# EAGLE schematic LAUNCHXL2_570LC43_RM57L (EAGLE 7.3.0), part 2 of 2
## Sheet 14 of 17
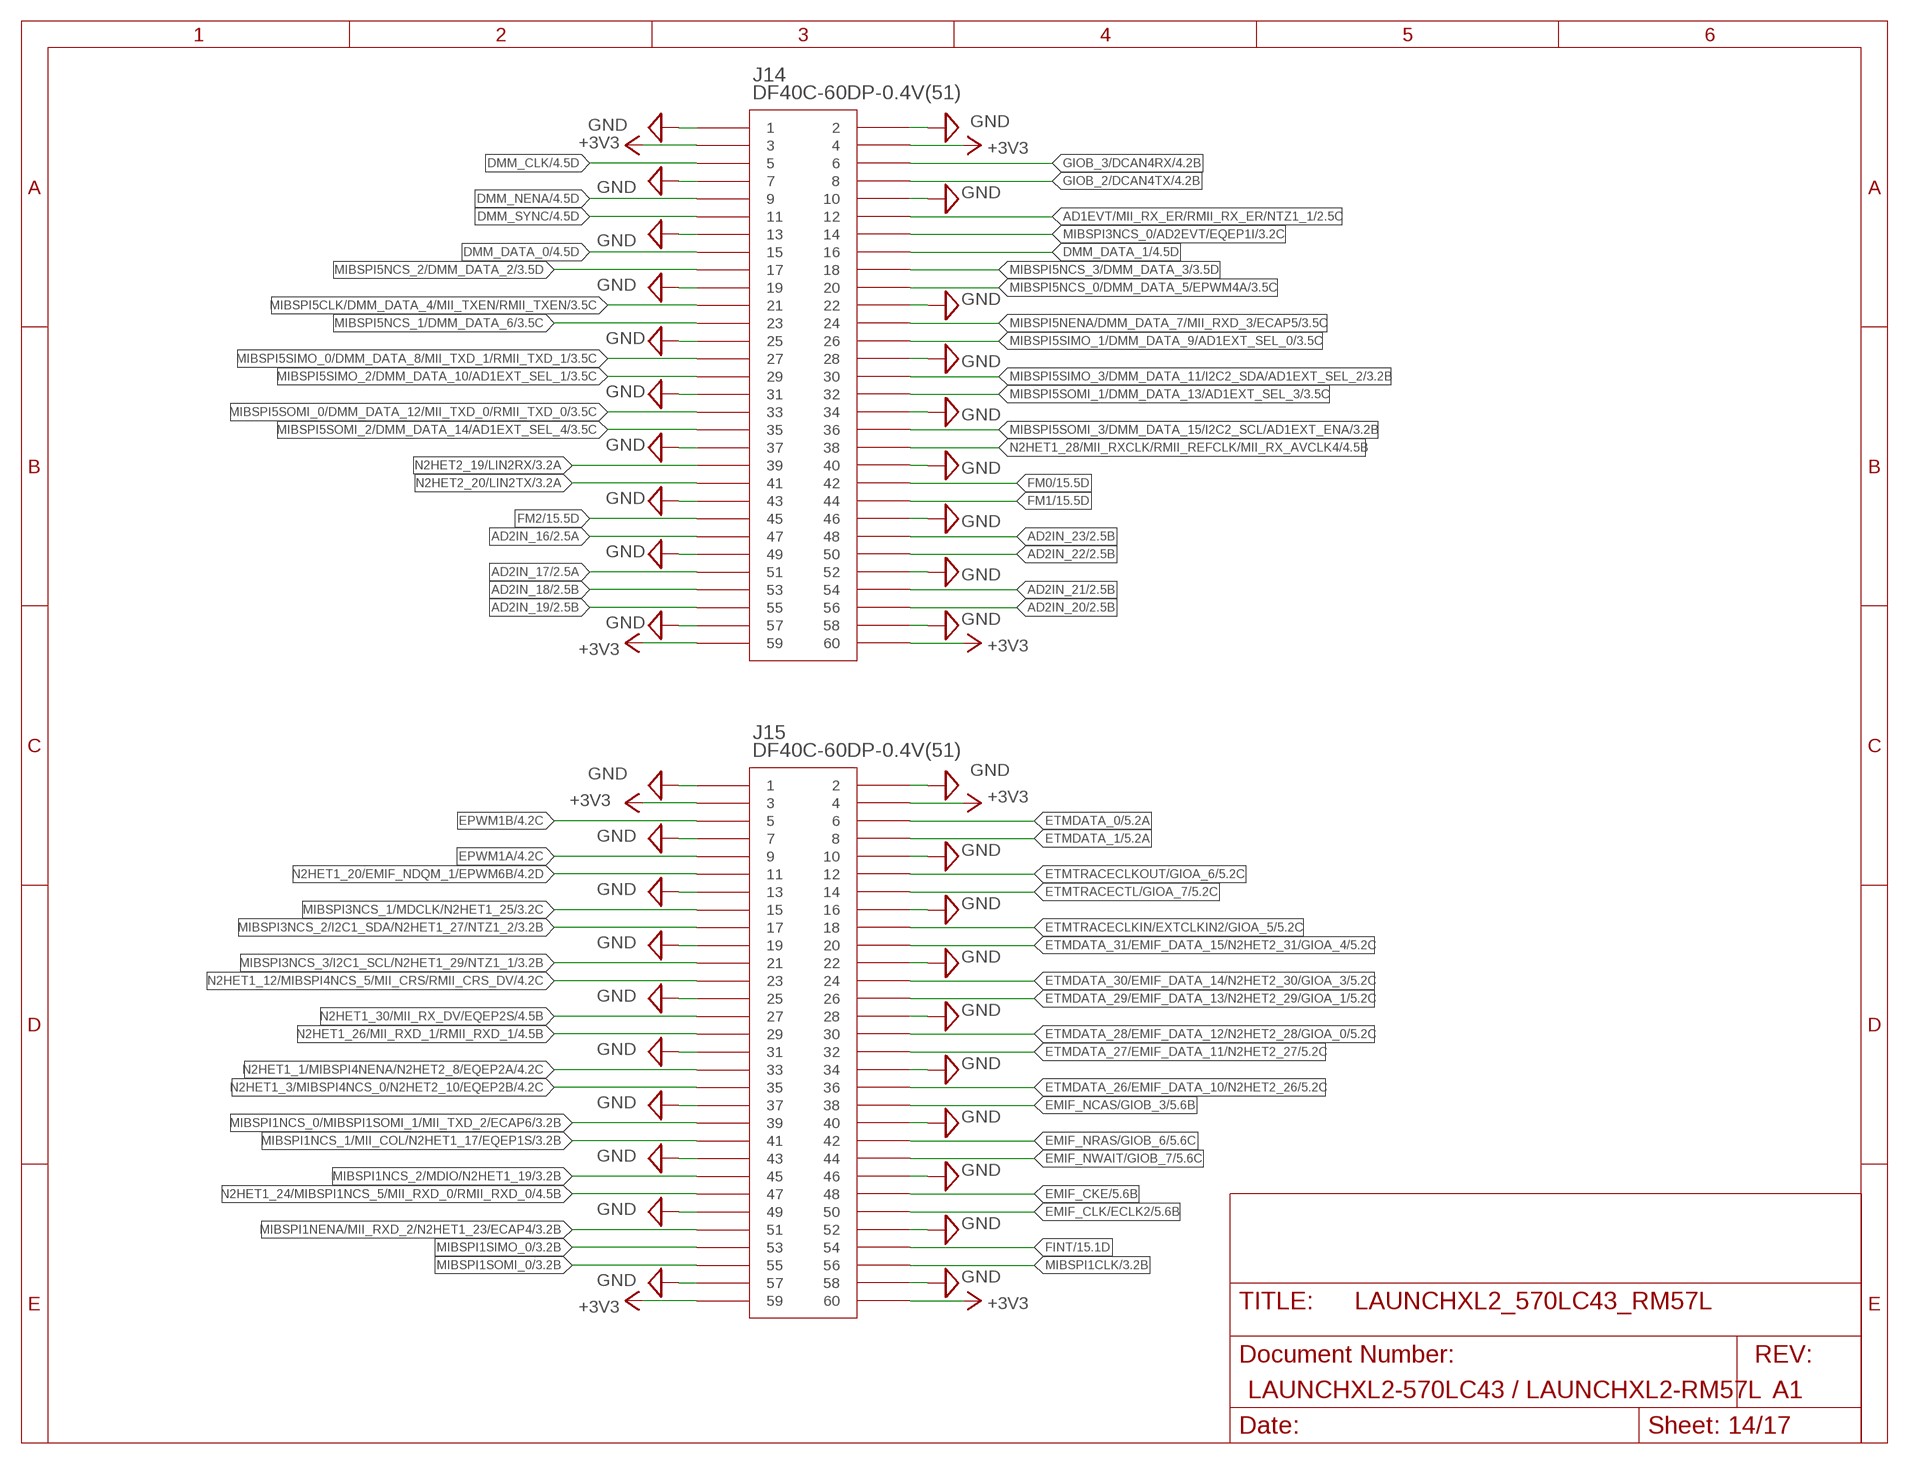
[diagram p13: schematic, sheet 14]

### Parts
J14  DF40C-60DP-0.4V(51)  [DF40C-60DP-0.4V(51)]
J15  DF40C-60DP-0.4V(51)  [DF40C-60DP-0.4V(51)]

### Nets
+3V3 [pwr]: J14.3 J14.4 J14.59 J14.60 J15.3 J15.4 J15.59 J15.60 ; also sheet 2,3,5,6,7,8,9,10,11,12,13,15,16
AD1EVT/MII_RX_ER/RMII_RX_ER/NTZ1_1: J14.12 ; also sheet 2,8
AD2IN_16: J14.47 ; also sheet 2
AD2IN_17: J14.51 ; also sheet 2
AD2IN_18: J14.53 ; also sheet 2
AD2IN_19: J14.55 ; also sheet 2
AD2IN_20: J14.56 ; also sheet 2
AD2IN_21: J14.54 ; also sheet 2
AD2IN_22: J14.50 ; also sheet 2
AD2IN_23: J14.48 ; also sheet 2,9
DMM_CLK: J14.5 ; also sheet 4
DMM_DATA_0: J14.15 ; also sheet 4
DMM_DATA_1: J14.16 ; also sheet 4
DMM_NENA: J14.9 ; also sheet 4
DMM_SYNC: J14.11 ; also sheet 4
EMIF_CKE [EMIF]: J15.48 ; also sheet 5
EMIF_CLK/ECLK2 [EMIF]: J15.50 ; also sheet 5
EMIF_NCAS/GIOB_3 [EMIF]: J15.38 ; also sheet 5
EMIF_NRAS/GIOB_6 [EMIF]: J15.42 ; also sheet 5
EMIF_NWAIT/GIOB_7 [EMIF]: J15.44 ; also sheet 5
EPWM1A: J15.9 ; also sheet 4,9
EPWM1B: J15.5 ; also sheet 4,9
ETMDATA_0: J15.6 ; also sheet 5
ETMDATA_1: J15.8 ; also sheet 5
ETMDATA_26/EMIF_DATA_10/N2HET2_26: J15.36 ; also sheet 5
ETMDATA_27/EMIF_DATA_11/N2HET2_27: J15.32 ; also sheet 5
ETMDATA_28/EMIF_DATA_12/N2HET2_28/GIOA_0: J15.30 ; also sheet 5
ETMDATA_29/EMIF_DATA_13/N2HET2_29/GIOA_1: J15.26 ; also sheet 5
ETMDATA_30/EMIF_DATA_14/N2HET2_30/GIOA_3: J15.24 ; also sheet 5
ETMDATA_31/EMIF_DATA_15/N2HET2_31/GIOA_4: J15.20 ; also sheet 5
ETMTRACECLKIN/EXTCLKIN2/GIOA_5: J15.18 ; also sheet 5
ETMTRACECLKOUT/GIOA_6: J15.12 ; also sheet 5
ETMTRACECTL/GIOA_7: J15.14 ; also sheet 5
FINT: J15.54 ; also sheet 15
FM0: J14.42 ; also sheet 15
FM1: J14.44 ; also sheet 15
FM2: J14.45 ; also sheet 15
GIOB_2/DCAN4TX: J14.8 ; also sheet 4,7,9
GIOB_3/DCAN4RX: J14.6 ; also sheet 4,7,9
GND [pwr]: J14.1 J14.2 J14.7 J14.10 J14.13 J14.19 J14.22 J14.25 J14.28 J14.31 J14.34 J14.37 J14.40 J14.43 J14.46 J14.49 J14.52 J14.57 J14.58 J15.1 J15.2 J15.7 J15.10 J15.13 J15.16 J15.19 J15.22 J15.25 J15.28 J15.31 J15.34 J15.37 J15.40 J15.43 J15.46 J15.49 J15.52 J15.57 J15.58 ; also sheet 2,3,5,6,7,8,9,10,11,12,13,15,16,17
MIBSPI1CLK: J15.56 ; also sheet 3,8,13
MIBSPI1NCS_0/MIBSPI1SOMI_1/MII_TXD_2/ECAP6: J15.39 ; also sheet 3,8
MIBSPI1NCS_1/MII_COL/N2HET1_17/EQEP1S: J15.41 ; also sheet 3,8
MIBSPI1NCS_2/MDIO/N2HET1_19: J15.45 ; also sheet 3,8
MIBSPI1NENA/MII_RXD_2/N2HET1_23/ECAP4: J15.51 ; also sheet 3,8
MIBSPI1SIMO_0: J15.53 ; also sheet 3,8
MIBSPI1SOMI_0: J15.55 ; also sheet 3,8
MIBSPI3NCS_0/AD2EVT/EQEP1I: J14.14 ; also sheet 3,8
MIBSPI3NCS_1/MDCLK/N2HET1_25: J15.15 ; also sheet 3,7
MIBSPI3NCS_2/I2C1_SDA/N2HET1_27/NTZ1_2: J15.17 ; also sheet 3,7
MIBSPI3NCS_3/I2C1_SCL/N2HET1_29/NTZ1_1: J15.21 ; also sheet 3,7
MIBSPI5CLK/DMM_DATA_4/MII_TXEN/RMII_TXEN: J14.21 ; also sheet 3,8
MIBSPI5NCS_0/DMM_DATA_5/EPWM4A: J14.20 ; also sheet 3,9
MIBSPI5NCS_1/DMM_DATA_6: J14.23 ; also sheet 3
MIBSPI5NCS_2/DMM_DATA_2: J14.17 ; also sheet 3
MIBSPI5NCS_3/DMM_DATA_3: J14.18 ; also sheet 3
MIBSPI5NENA/DMM_DATA_7/MII_RXD_3/ECAP5: J14.24 ; also sheet 3,8
MIBSPI5SIMO_0/DMM_DATA_8/MII_TXD_1/RMII_TXD_1: J14.27 ; also sheet 3,8
MIBSPI5SIMO_1/DMM_DATA_9/AD1EXT_SEL_0: J14.26 ; also sheet 3
MIBSPI5SIMO_2/DMM_DATA_10/AD1EXT_SEL_1: J14.29 ; also sheet 3
MIBSPI5SIMO_3/DMM_DATA_11/I2C2_SDA/AD1EXT_SEL_2: J14.30 ; also sheet 3,9
MIBSPI5SOMI_0/DMM_DATA_12/MII_TXD_0/RMII_TXD_0: J14.33 ; also sheet 3,8
MIBSPI5SOMI_1/DMM_DATA_13/AD1EXT_SEL_3: J14.32 ; also sheet 3
MIBSPI5SOMI_2/DMM_DATA_14/AD1EXT_SEL_4: J14.35 ; also sheet 3
MIBSPI5SOMI_3/DMM_DATA_15/I2C2_SCL/AD1EXT_ENA: J14.36 ; also sheet 3,9
N2HET1_1/MIBSPI4NENA/N2HET2_8/EQEP2A: J15.33 ; also sheet 4,8,9
N2HET1_3/MIBSPI4NCS_0/N2HET2_10/EQEP2B: J15.35 ; also sheet 4,9
N2HET1_12/MIBSPI4NCS_5/MII_CRS/RMII_CRS_DV: J15.23 ; also sheet 4,7
N2HET1_20/EMIF_NDQM_1/EPWM6B: J15.11 ; also sheet 4
N2HET1_24/MIBSPI1NCS_5/MII_RXD_0/RMII_RXD_0: J15.47 ; also sheet 4,8
N2HET1_26/MII_RXD_1/RMII_RXD_1: J15.29 ; also sheet 4,8
N2HET1_28/MII_RXCLK/RMII_REFCLK/MII_RX_AVCLK4: J14.38 ; also sheet 4,8
N2HET1_30/MII_RX_DV/EQEP2S: J15.27 ; also sheet 4,7
N2HET2_19/LIN2RX: J14.39 ; also sheet 3,9
N2HET2_20/LIN2TX: J14.41 ; also sheet 3,9

## Sheet 15 of 17
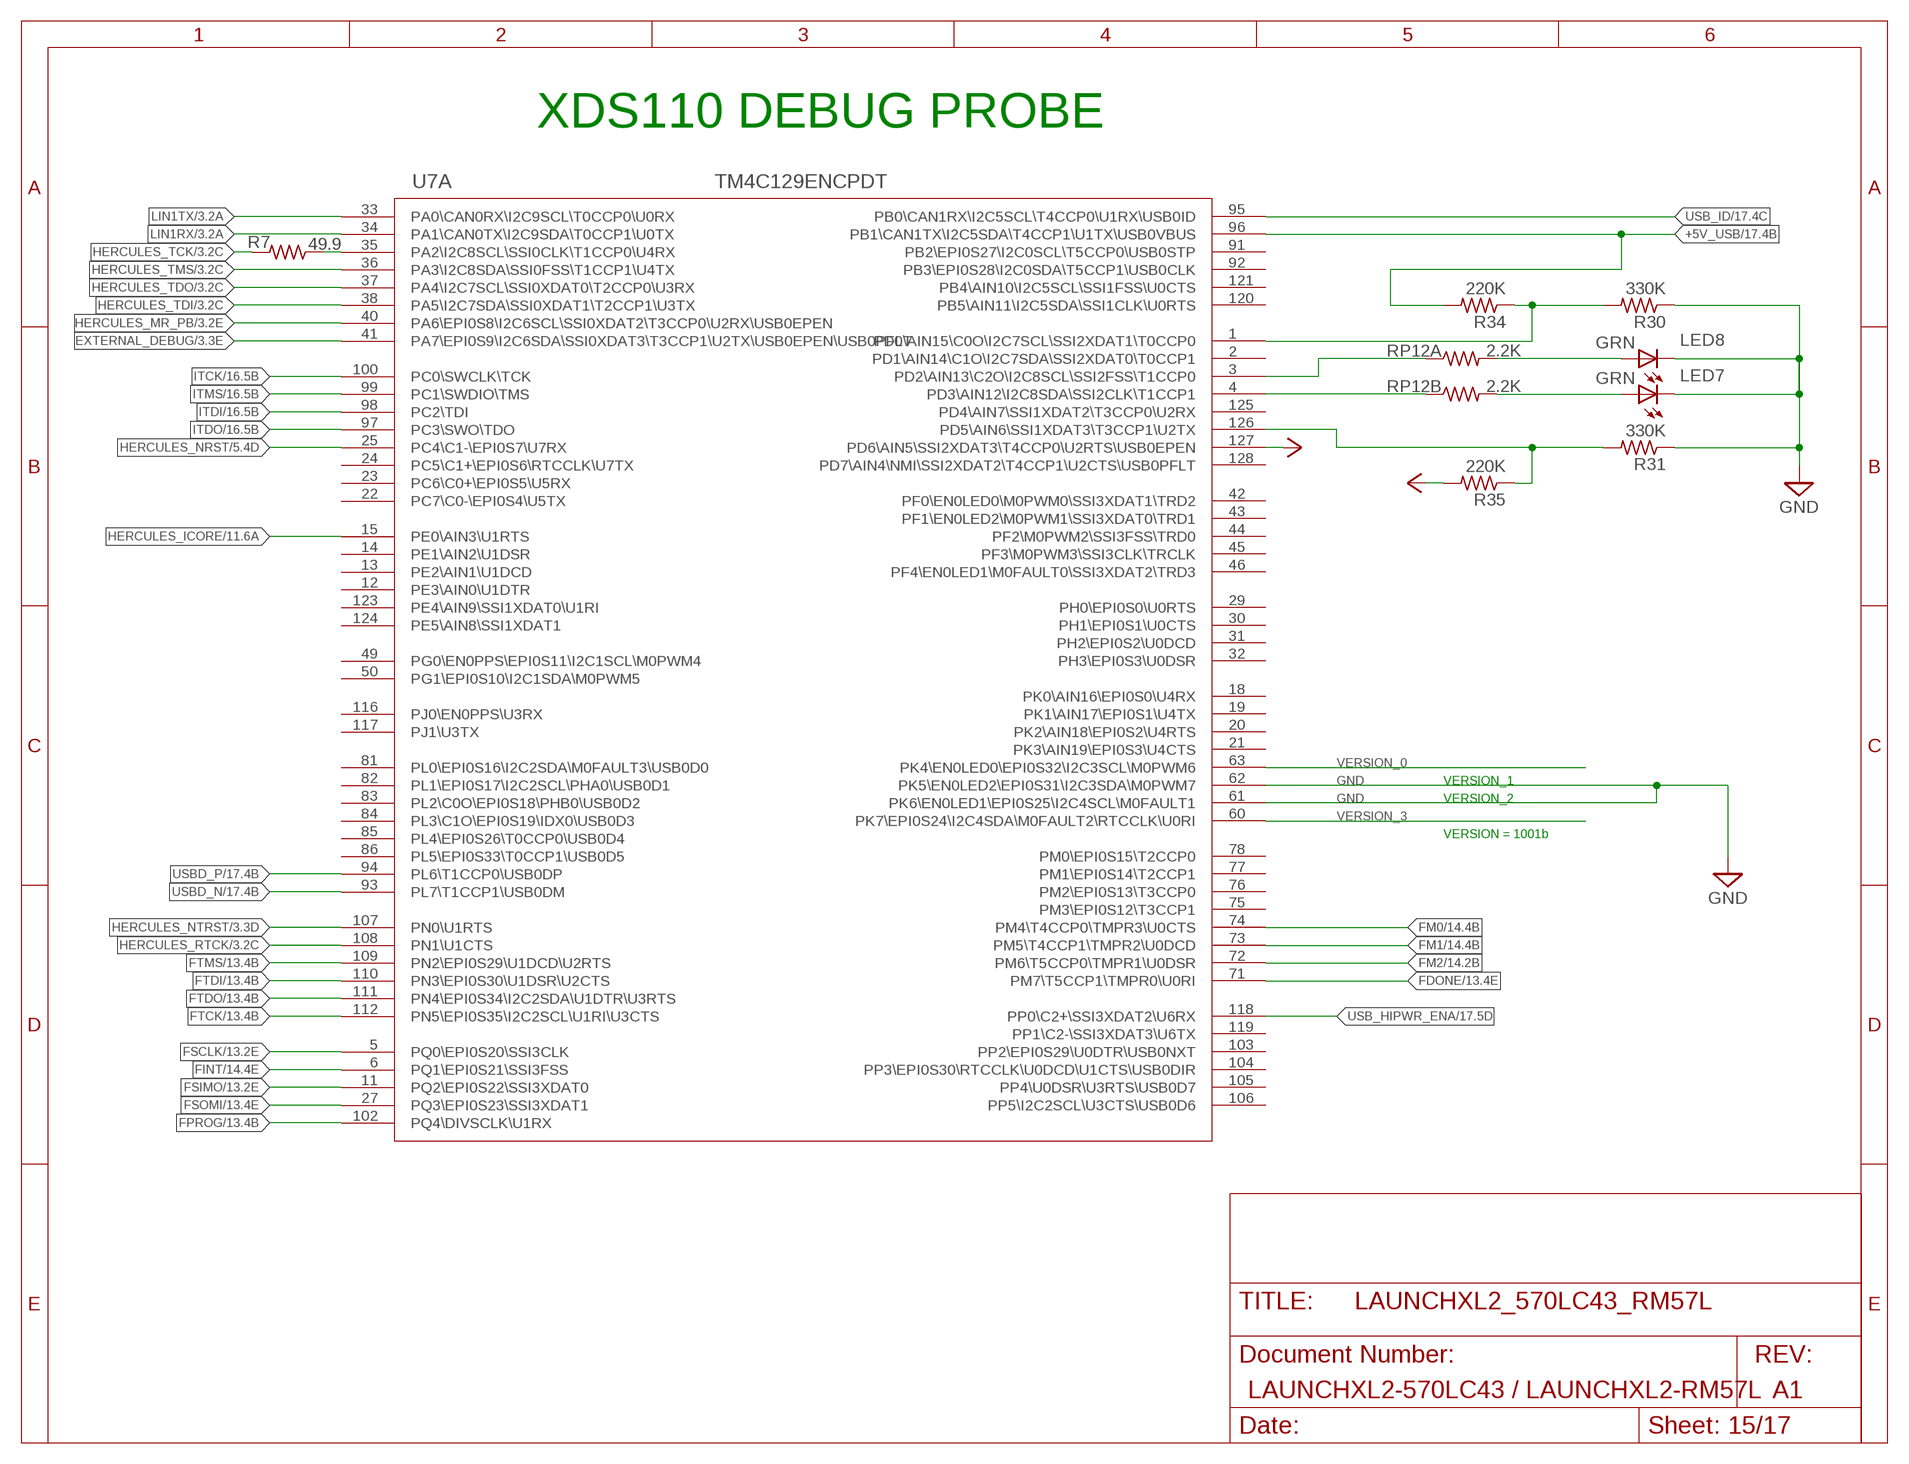
[diagram p14: schematic, sheet 15]

### Parts
LED7  GRN  LEDCHIPLED_0603  [CHIPLED_0603]
LED8  GRN  LEDCHIPLED_0603  [CHIPLED_0603]
R7  49.9  R-US_R0201  [R0201]
R30  330K  R-US_R0201  [R0201]
R31  330K  R-US_R0201  [R0201]
R34  220K  R-US_R0201  [R0201]
R35  220K  R-US_R0201  [R0201]
RP12  2.2K  R-ARRAY-8_  [RP8_1506_1606]
U7  TM4C129ENCPDT  [PDT128]

### Nets
+1V2 [pwr]: U7.127(A:PD6\AIN5\SSI2XDAT3\T4CCP0\U2RTS\USB0EPEN) ; also sheet 5,6,11
+3V3 [pwr]: R35.2 ; also sheet 2,3,5,6,7,8,9,10,11,12,13,14,16
+5V_USB: R34.2 U7.96(A:PB1\CAN1TX\I2C5SDA\T4CCP1\U1TX\USB0VBUS) ; also sheet 17
EXTERNAL_DEBUG: U7.41(A:PA7\EPI0S9\I2C6SDA\SSI0XDAT3\T3CCP1\U2TX\USB0EPEN\USB0PFLT) ; also sheet 3,13
FDONE: U7.71(A:PM7\T5CCP1\TMPR0\U0RI) ; also sheet 13
FINT: U7.6(A:PQ1\EPI0S21\SSI3FSS) ; also sheet 14
FM0: U7.74(A:PM4\T4CCP0\TMPR3\U0CTS) ; also sheet 14
FM1: U7.73(A:PM5\T4CCP1\TMPR2\U0DCD) ; also sheet 14
FM2: U7.72(A:PM6\T5CCP0\TMPR1\U0DSR) ; also sheet 14
FPROG: U7.102(A:PQ4\DIVSCLK\U1RX) ; also sheet 13
FSCLK: U7.5(A:PQ0\EPI0S20\SSI3CLK) ; also sheet 13
FSIMO: U7.11(A:PQ2\EPI0S22\SSI3XDAT0) ; also sheet 13
FSOMI: U7.27(A:PQ3\EPI0S23\SSI3XDAT1) ; also sheet 13
FTCK: U7.112(A:PN5\EPI0S35\I2C2SCL\U1RI\U3CTS) ; also sheet 13
FTDI: U7.110(A:PN3\EPI0S30\U1DSR\U2CTS) ; also sheet 13
FTDO: U7.111(A:PN4\EPI0S34\I2C2SDA\U1DTR\U3RTS) ; also sheet 13
FTMS: U7.109(A:PN2\EPI0S29\U1DCD\U2RTS) ; also sheet 13
GND [pwr]: LED7.C LED8.C R30.1 R31.1 U7.61(A:PK6\EN0LED1\EPI0S25\I2C4SCL\M0FAULT1) U7.62(A:PK5\EN0LED2\EPI0S31\I2C3SDA\M0PWM7) ; also sheet 2,3,5,6,7,8,9,10,11,12,13,14,16,17
HERCULES_ICORE: U7.15(A:PE0\AIN3\U1RTS) ; also sheet 11
HERCULES_MR_PB: U7.40(A:PA6\EPI0S8\I2C6SCL\SSI0XDAT2\T3CCP0\U2RX\USB0EPEN) ; also sheet 3,5,13
HERCULES_NRST: U7.25(A:PC4\C1-\EPI0S7\U7RX) ; also sheet 5,7,8,9,13
HERCULES_NTRST: U7.107(A:PN0\U1RTS) ; also sheet 3,13
HERCULES_RTCK [ETM]: U7.108(A:PN1\U1CTS) ; also sheet 3,13
HERCULES_TCK [ETM]: R7.2 ; also sheet 3,13
HERCULES_TDI: U7.38(A:PA5\I2C7SDA\SSI0XDAT1\T2CCP1\U3TX) ; also sheet 3,13
HERCULES_TDO: U7.37(A:PA4\I2C7SCL\SSI0XDAT0\T2CCP0\U3RX) ; also sheet 3,13
HERCULES_TMS: U7.36(A:PA3\I2C8SDA\SSI0FSS\T1CCP1\U4TX) ; also sheet 3,13
ITCK: U7.100(A:PC0\SWCLK\TCK) ; also sheet 16
ITDI: U7.98(A:PC2\TDI) ; also sheet 16
ITDO: U7.97(A:PC3\SWO\TDO) ; also sheet 16
ITMS: U7.99(A:PC1\SWDIO\TMS) ; also sheet 16
LIN1RX: U7.34(A:PA1\CAN0TX\I2C9SDA\T0CCP1\U0TX) ; also sheet 3,8
LIN1TX: U7.33(A:PA0\CAN0RX\I2C9SCL\T0CCP0\U0RX) ; also sheet 3,8
N$1: RP12.3 U7.4(A:PD3\AIN12\I2C8SDA\SSI2CLK\T1CCP1)
N$2: LED7.A RP12.4
N$6: RP12.1 U7.3(A:PD2\AIN13\C2O\I2C8SCL\SSI2FSS\T1CCP0)
N$7: R7.1 U7.35(A:PA2\I2C8SCL\SSI0CLK\T1CCP0\U4RX)
N$24: R31.2 R35.1 U7.126(A:PD5\AIN6\SSI1XDAT3\T3CCP1\U2TX)
N$43: R30.2 R34.1 U7.1(A:PD0\AIN15\C0O\I2C7SCL\SSI2XDAT1\T0CCP0)
N$58: LED8.A RP12.2
USB_HIPWR_ENA: U7.118(A:PP0\C2+\SSI3XDAT2\U6RX) ; also sheet 17
USB_ID: U7.95(A:PB0\CAN1RX\I2C5SCL\T4CCP0\U1RX\USB0ID) ; also sheet 17
USBD_N [USBD]: U7.93(A:PL7\T1CCP1\USB0DM) ; also sheet 17
USBD_P [USBD]: U7.94(A:PL6\T1CCP0\USB0DP) ; also sheet 17
VERSION_0: U7.63(A:PK4\EN0LED0\EPI0S32\I2C3SCL\M0PWM6)
VERSION_3: U7.60(A:PK7\EPI0S24\I2C4SDA\M0FAULT2\RTCCLK\U0RI)
Unconnected: RP12.7 RP12.8 RP12.9 RP12.10 RP12.15 RP12.16 U7.2(A:PD1\AIN14\C1O\I2C7SDA\SSI2XDAT0\T0CCP1) U7.12(A:PE3\AIN0\U1DTR) U7.13(A:PE2\AIN1\U1DCD) U7.14(A:PE1\AIN2\U1DSR) U7.18(A:PK0\AIN16\EPI0S0\U4RX) U7.19(A:PK1\AIN17\EPI0S1\U4TX) U7.20(A:PK2\AIN18\EPI0S2\U4RTS) U7.21(A:PK3\AIN19\EPI0S3\U4CTS) U7.22(A:PC7\C0-\EPI0S4\U5TX) U7.23(A:PC6\C0+\EPI0S5\U5RX) U7.24(A:PC5\C1+\EPI0S6\RTCCLK\U7TX) U7.29(A:PH0\EPI0S0\U0RTS) U7.30(A:PH1\EPI0S1\U0CTS) U7.31(A:PH2\EPI0S2\U0DCD) U7.32(A:PH3\EPI0S3\U0DSR) U7.42(A:PF0\EN0LED0\M0PWM0\SSI3XDAT1\TRD2) U7.43(A:PF1\EN0LED2\M0PWM1\SSI3XDAT0\TRD1) U7.44(A:PF2\M0PWM2\SSI3FSS\TRD0) U7.45(A:PF3\M0PWM3\SSI3CLK\TRCLK) U7.46(A:PF4\EN0LED1\M0FAULT0\SSI3XDAT2\TRD3) U7.49(A:PG0\EN0PPS\EPI0S11\I2C1SCL\M0PWM4) U7.50(A:PG1\EPI0S10\I2C1SDA\M0PWM5) U7.75(A:PM3\EPI0S12\T3CCP1) U7.76(A:PM2\EPI0S13\T3CCP0) U7.77(A:PM1\EPI0S14\T2CCP1) U7.78(A:PM0\EPI0S15\T2CCP0) U7.81(A:PL0\EPI0S16\I2C2SDA\M0FAULT3\USB0D0) U7.82(A:PL1\EPI0S17\I2C2SCL\PHA0\USB0D1) U7.83(A:PL2\C0O\EPI0S18\PHB0\USB0D2) U7.84(A:PL3\C1O\EPI0S19\IDX0\USB0D3) U7.85(A:PL4\EPI0S26\T0CCP0\USB0D4) U7.86(A:PL5\EPI0S33\T0CCP1\USB0D5) U7.91(A:PB2\EPI0S27\I2C0SCL\T5CCP0\USB0STP) U7.92(A:PB3\EPI0S28\I2C0SDA\T5CCP1\USB0CLK) U7.103(A:PP2\EPI0S29\U0DTR\USB0NXT) U7.104(A:PP3\EPI0S30\RTCCLK\U0DCD\U1CTS\USB0DIR) U7.105(A:PP4\U0DSR\U3RTS\USB0D7) U7.106(A:PP5\I2C2SCL\U3CTS\USB0D6) U7.116(A:PJ0\EN0PPS\U3RX) U7.117(A:PJ1\U3TX) U7.119(A:PP1\C2-\SSI3XDAT3\U6TX) U7.120(A:PB5\AIN11\I2C5SDA\SSI1CLK\U0RTS) U7.121(A:PB4\AIN10\I2C5SCL\SSI1FSS\U0CTS) U7.123(A:PE4\AIN9\SSI1XDAT0\U1RI) U7.124(A:PE5\AIN8\SSI1XDAT1) U7.125(A:PD4\AIN7\SSI1XDAT2\T3CCP0\U2RX) U7.128(A:PD7\AIN4\NMI\SSI2XDAT2\T4CCP1\U2CTS\USB0PFLT)

### Notes on the sheet
- XDS110 DEBUG PROBE
- VERSION_1
- VERSION_2
- VERSION = 1001b

## Sheet 16 of 17
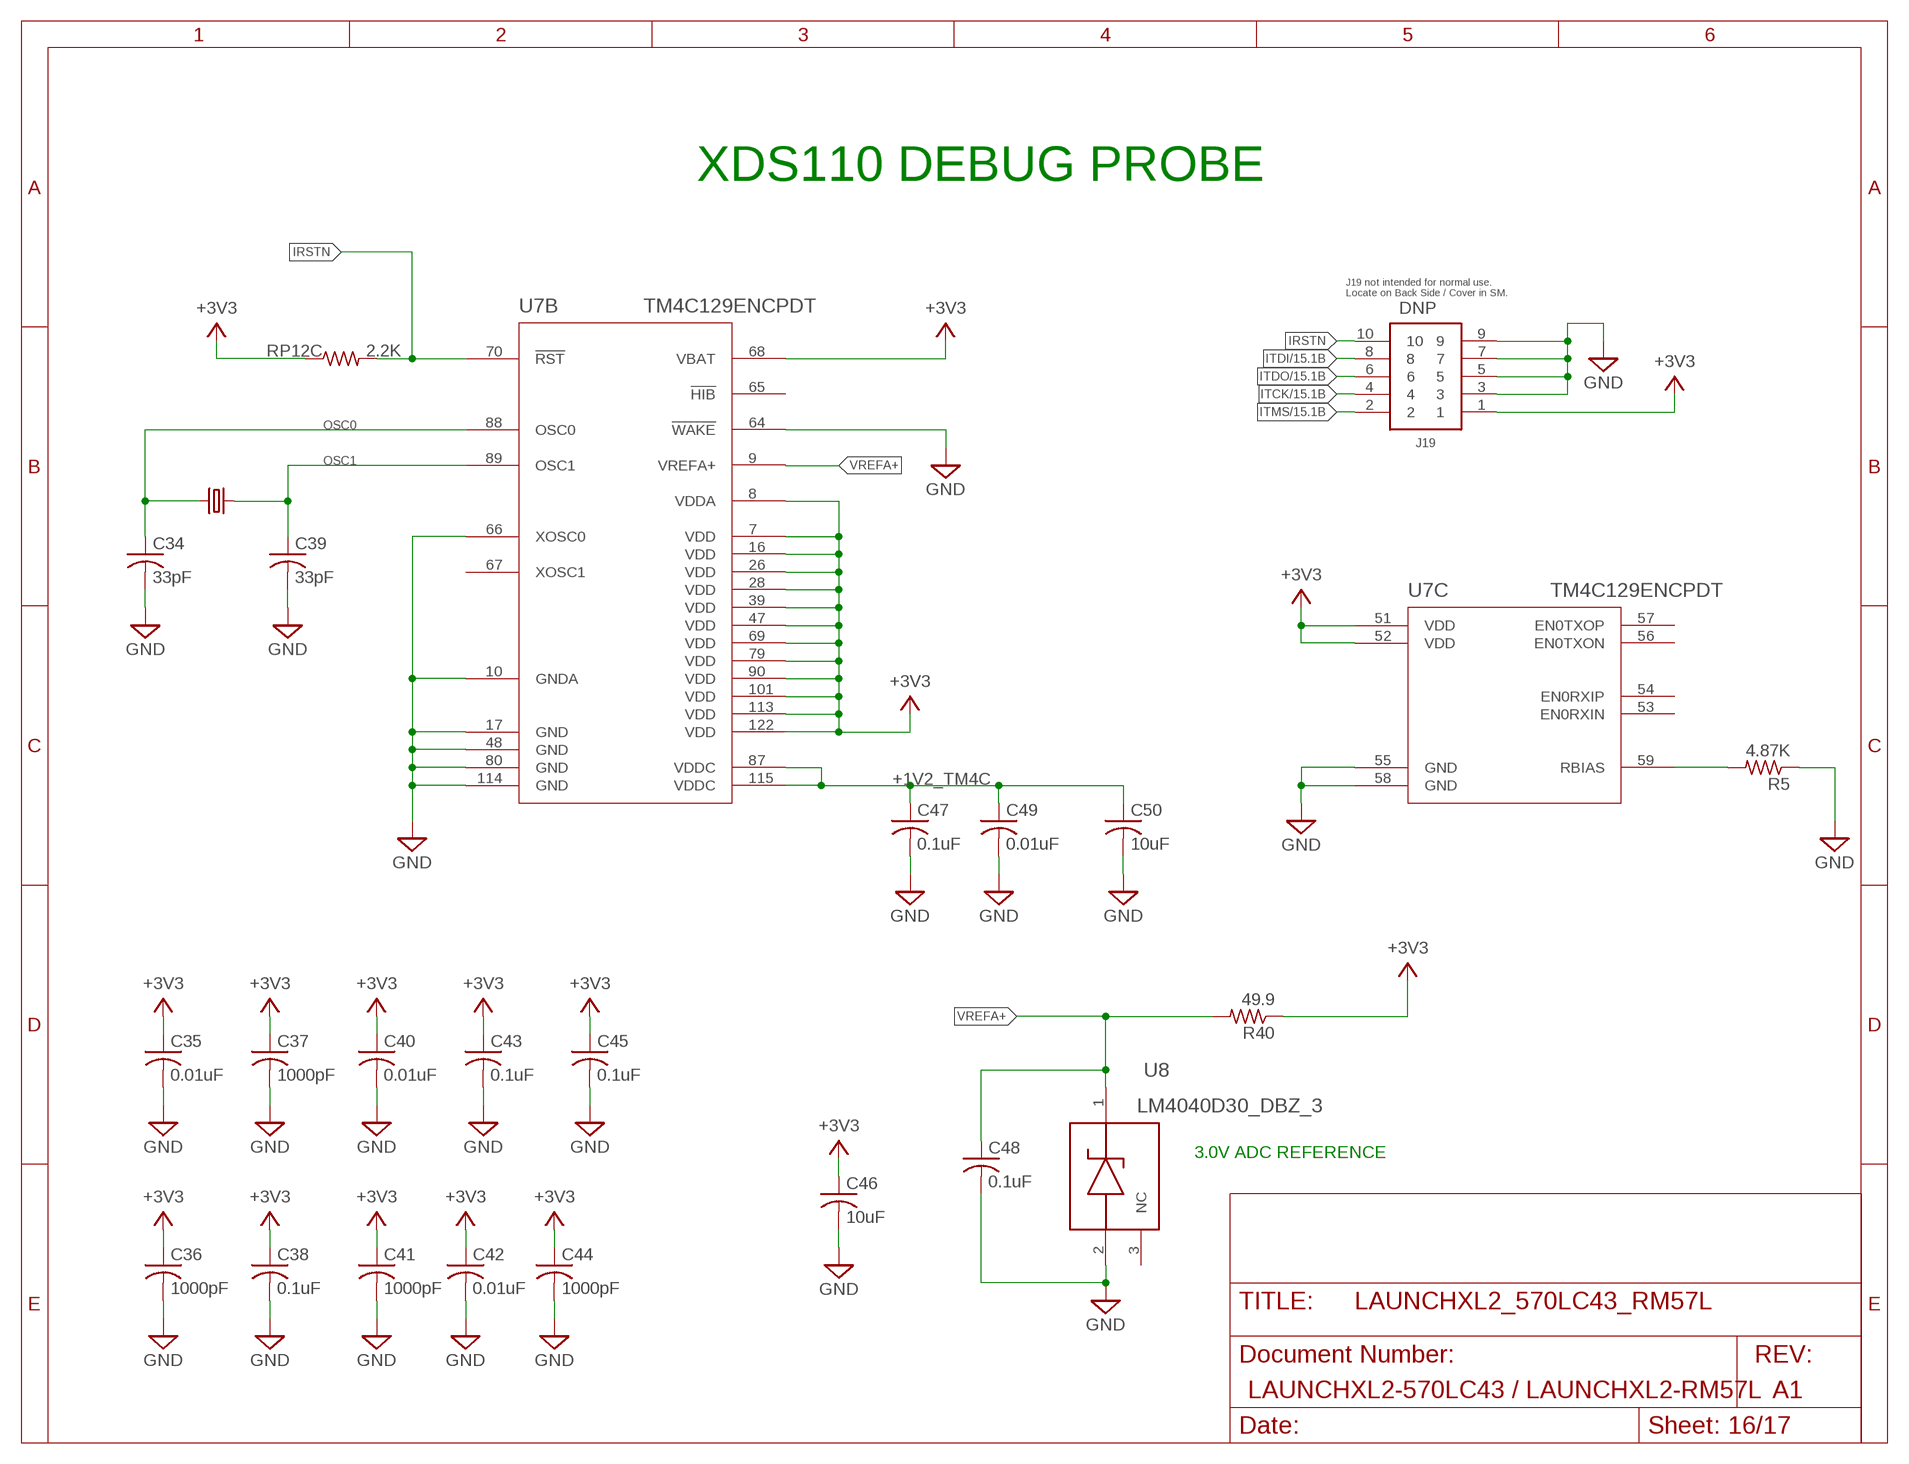
[diagram p15: schematic, sheet 16]

### Parts
C34  33pF  C-USC0201  [C0201]
C35  0.01uF  C-USC0201  [C0201]
C36  1000pF  C-USC0201  [C0201]
C37  1000pF  C-USC0201  [C0201]
C38  0.1uF  C-USC0201  [C0201]
C39  33pF  C-USC0201  [C0201]
C40  0.01uF  C-USC0201  [C0201]
C41  1000pF  C-USC0201  [C0201]
C42  0.01uF  C-USC0201  [C0201]
C43  0.1uF  C-USC0201  [C0201]
C44  1000pF  C-USC0201  [C0201]
C45  0.1uF  C-USC0201  [C0201]
C46  10uF  C-USC0805K  [C0805K]
C47  0.1uF  C-USC0201  [C0201]
C48  0.1uF  C-USC0201  [C0201]
C49  0.01uF  C-USC0201  [C0201]
C50  10uF  C-USC0805K  [C0805K]
J19  FTSH-105-01-F-DV_SMD  [FTSH-105-01-F-DV]
R5  4.87K  R-US_R0201  [R0201]
R40  49.9  R-US_R0201  [R0201]
U8  LM4040D30_DBZ_3  [DBZ3]
Y2  16.00MHZ  CRYSTALCSM-3X  [CSM-3X]

### Nets
+1V2_TM4C [pwr]: C47.1 C49.1 C50.1 U7.87(B:VDDC) U7.115(B:VDDC)
+3V3 [pwr]: C35.1 C36.1 C37.1 C38.1 C40.1 C41.1 C42.1 C43.1 C44.1 C45.1 C46.1 J19.1 R40.1 RP12.5 U7.7(B:VDD) U7.8(B:VDDA) U7.16(B:VDD) U7.26(B:VDD) U7.28(B:VDD) U7.39(B:VDD) U7.47(B:VDD) U7.51(C:VDD) U7.52(C:VDD) U7.68(B:VBAT) U7.69(B:VDD) U7.79(B:VDD) U7.90(B:VDD) U7.101(B:VDD) U7.113(B:VDD) U7.122(B:VDD) ; also sheet 2,3,5,6,7,8,9,10,11,12,13,14,15
GND [pwr]: C34.2 C35.2 C36.2 C37.2 C38.2 C39.2 C40.2 C41.2 C42.2 C43.2 C44.2 C45.2 C46.2 C47.2 C48.2 C49.2 C50.2 J19.3 J19.5 J19.7 J19.9 R5.1 U7.10(B:GNDA) U7.17(B:GND) U7.48(B:GND) U7.55(C:GND) U7.58(C:GND) U7.64(B:!WAKE) U7.66(B:XOSC0) U7.80(B:GND) U7.114(B:GND) U8.2(ANODE) ; also sheet 2,3,5,6,7,8,9,10,11,12,13,14,15,17
IRSTN: J19.10 RP12.6 U7.70(B:!RST)
ITCK: J19.4 ; also sheet 15
ITDI: J19.8 ; also sheet 15
ITDO: J19.6 ; also sheet 15
ITMS: J19.2 ; also sheet 15
N$20: R5.2 U7.59(C:RBIAS)
OSC0: C34.1 U7.88(B:OSC0) Y2.2
OSC1: C39.1 U7.89(B:OSC1) Y2.1
VREFA+: C48.1 R40.2 U7.9(B:VREFA+) U8.1(CATHODE)
Unconnected: U7.53(C:EN0RXIN) U7.54(C:EN0RXIP) U7.56(C:EN0TXON) U7.57(C:EN0TXOP) U7.65(B:!HIB) U7.67(B:XOSC1) U8.3(NC)

### Notes on the sheet
- XDS110 DEBUG PROBE
- J19 not intended for normal use.
  Locate on Back Side / Cover in SM.
- 3.0V ADC REFERENCE

## Sheet 17 of 17
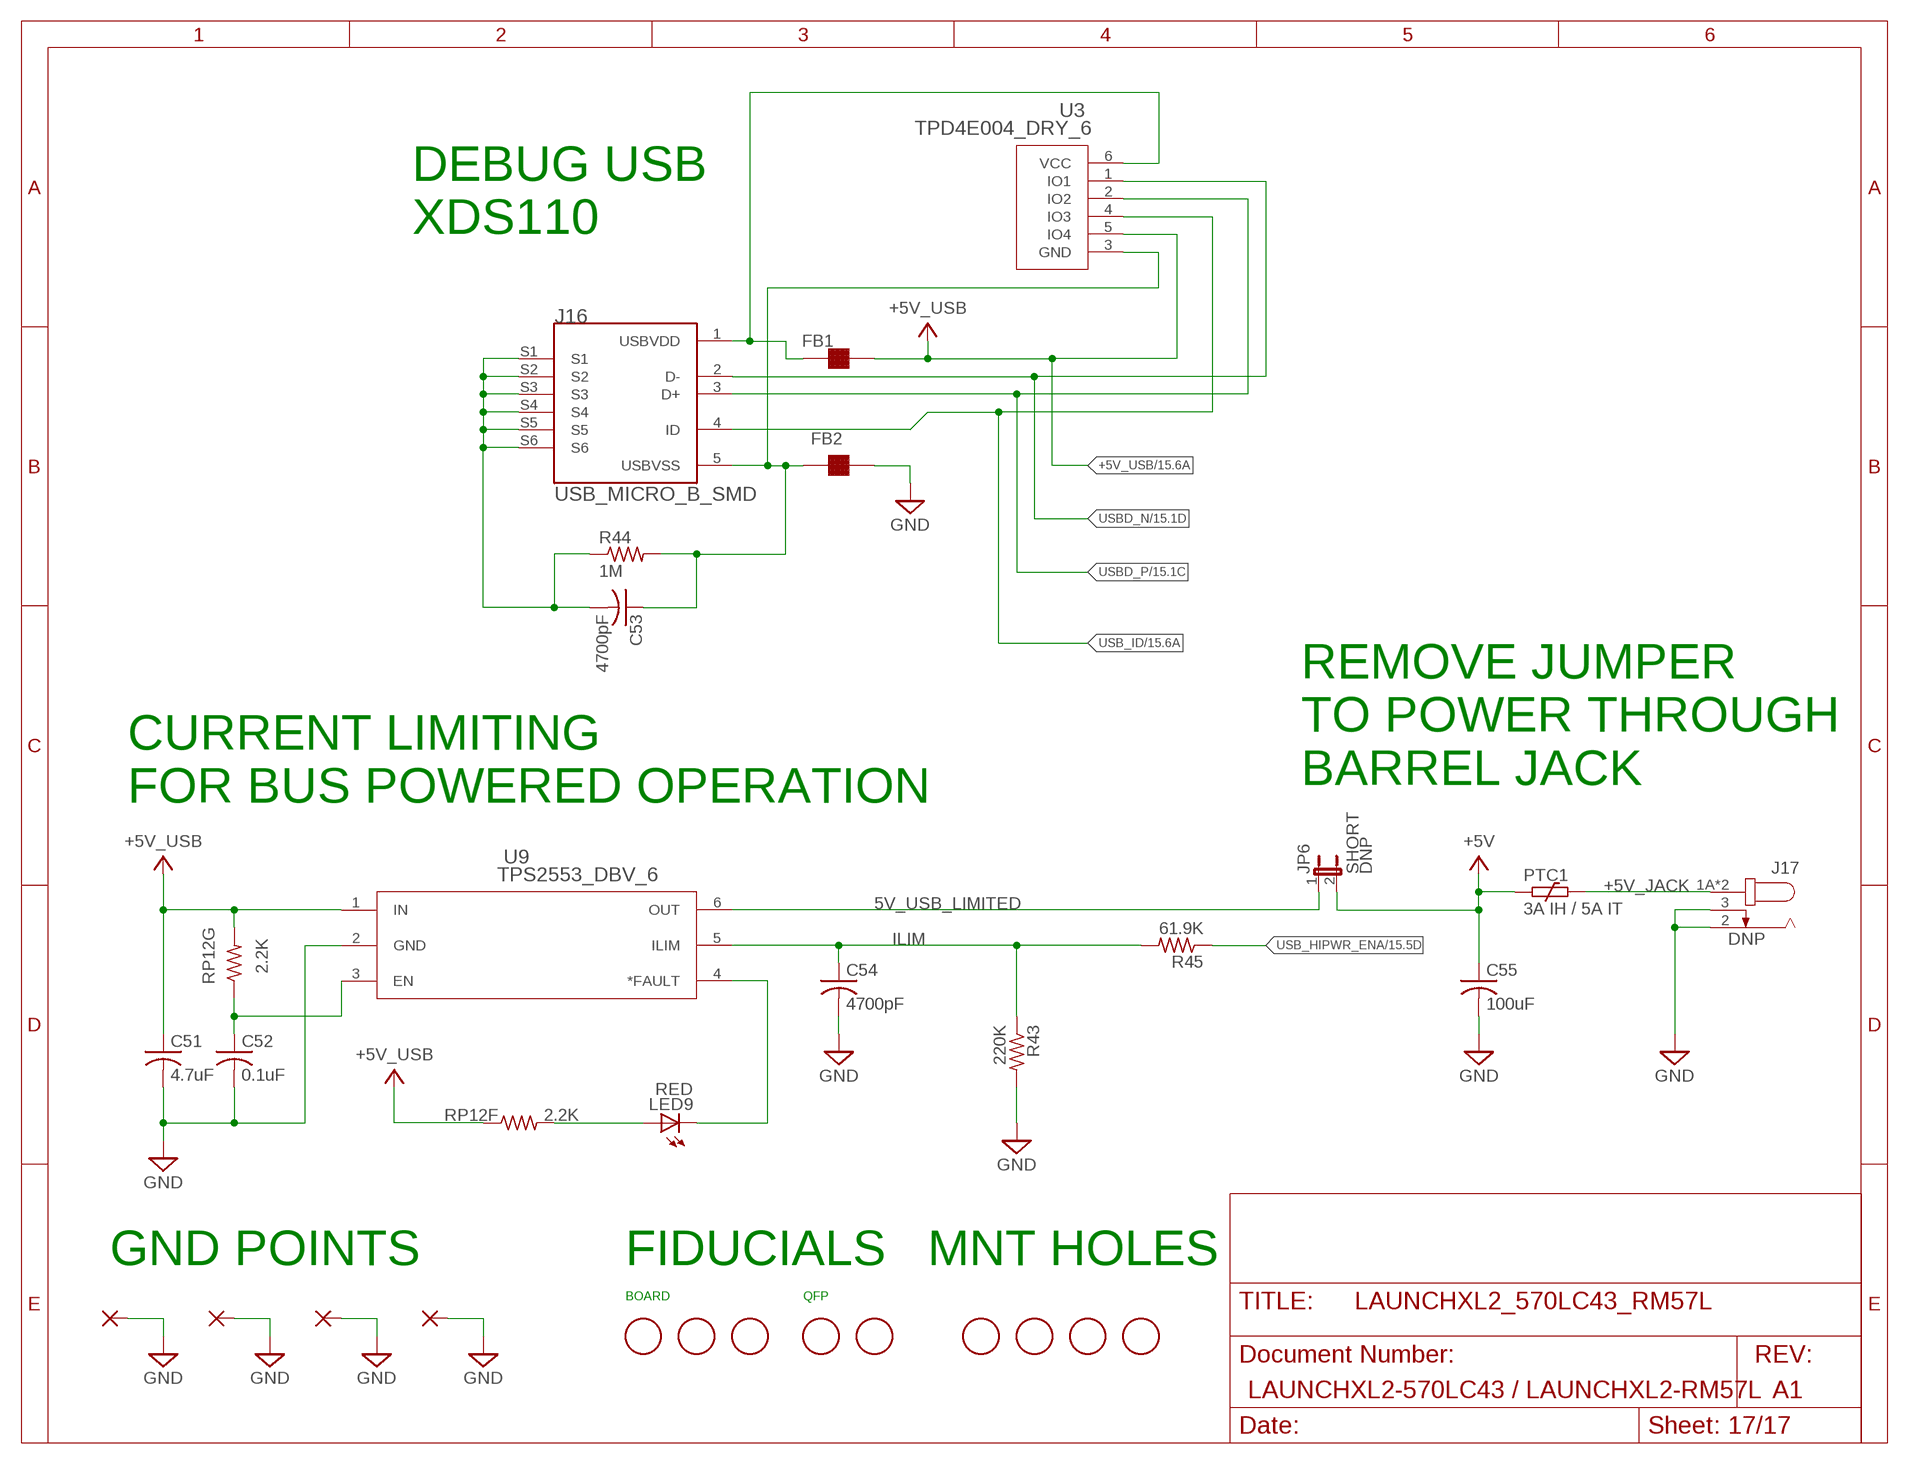
[diagram p16: schematic, sheet 17]

### Parts
C51  4.7uF  C-USC0603K  [C0603K]
C52  0.1uF  C-USC0201  [C0201]
C53  4700pF  C-USC0201  [C0201]
C54  4700pF  C-USC0201  [C0201]
C55  100uF  C-USC1206K  [C1206K]
FB1  30 OHM @ 100MHz  FERRITEBEAD2R0603  [R0603]
FB2  30 OHM @ 100MHz  FERRITEBEAD2R0603  [R0603]
FID1  DNP  FIDUCIAL  [FIDUCIAL_1MM]
FID2  DNP  FIDUCIAL  [FIDUCIAL_1MM]
FID3  DNP  FIDUCIAL  [FIDUCIAL_1MM]
FID4  DNP  FIDUCIAL  [FIDUCIAL_1MM]
FID5  DNP  FIDUCIAL  [FIDUCIAL_1MM]
J16  USB_MICRO_B_SMD  [USB_MICRO_B_SMD]
J17  JACK-PLUGCUI_PJ002BH  [CUI_PJ002BH]
JP6  SHORT  JP1EJP1_SHORT  [JP1_SHORT]
LED9  RED  LEDCHIPLED_0603  [CHIPLED_0603]
MH1  DNP  MHMS_2_56  [MH_94_200]
MH2  DNP  MHMS_2_56  [MH_94_200]
MH3  DNP  MHMS_2_56  [MH_94_200]
MH4  DNP  MHMS_2_56  [MH_94_200]
PAD9  DNP  WIREPAD2,54/1,1  [2,54/1,1]
PAD10  DNP  WIREPAD2,54/1,1  [2,54/1,1]
PAD11  DNP  WIREPAD2,54/1,1  [2,54/1,1]
PAD12  DNP  WIREPAD2,54/1,1  [2,54/1,1]
PTC1  3A IH / 5A IT  PTC1812  [R1812]
R43  220K  R-US_R0201  [R0201]
R44  1M  R-US_R0201  [R0201]
R45  61.9K  R-US_R0201  [R0201]
U3  TPD4E004_DRY_6  [DRY6]
U9  TPS2553_DBV_6  [DBV6]

### Nets
5V_USB_LIMITED: JP6.1 U9.6(OUT)
+5V [pwr]: C55.1 JP6.2 PTC1.1 ; also sheet 2,7,8,9,11
+5V_JACK: J17.1A J17.1B PTC1.2
+5V_USB: C51.1 FB1.2(B) RP12.11 RP12.14 U3.5(IO4) U9.1(IN) ; also sheet 15
GND [pwr]: C51.2 C52.2 C54.2 C55.2 FB2.2(B) J17.2 J17.3 PAD9.1(P) PAD10.1(P) PAD11.1(P) PAD12.1(P) R43.2 U9.2(GND) ; also sheet 2,3,5,6,7,8,9,10,11,12,13,14,15,16
ILIM: C54.1 R43.1 R45.2 U9.5(ILIM)
N$8: LED9.A RP12.12
N$23: C52.1 RP12.13 U9.3(EN)
USB_HIPWR_ENA: R45.1 ; also sheet 15
USB_ID: J16.4(ID) U3.4(IO3) ; also sheet 15
USB_PWRFAULT: LED9.C U9.4(*FAULT)
USB_SHIELD: C53.2 J16.S1 J16.S2 J16.S3 J16.S4 J16.S5 J16.S6 R44.1
USBD_N [USBD]: J16.2(D-) U3.1(IO1) ; also sheet 15
USBD_P [USBD]: J16.3(D+) U3.2(IO2) ; also sheet 15
USBVDD: FB1.1(A) J16.1(USBVDD) U3.6(VCC)
USBVSS: C53.1 FB2.1(A) J16.5(USBVSS) R44.2 U3.3(GND)

### Notes on the sheet
- DEBUG USB
  XDS110
- REMOVE JUMPER
  TO POWER THROUGH
  BARREL JACK
- CURRENT LIMITING
  FOR BUS POWERED OPERATION
- GND POINTS | FIDUCIALS | MNT HOLES
- BOARD | QFP

## Library data of the parts
+1V2 PAD9-PAD12 = LAUNCHXL2_570LC43_RM57L:WIREPAD: Wire PAD connect wire on PCB; BOM: EXCLUDE; DNP: T; PARTNO: BOM_EXCLUDE
C1 C2 C34 C39 = LAUNCHXL2_570LC43_RM57L:C-US: CAPACITOR, American symbol; PARTNO: CC0201JRNPO8BN330
C3 C7 C11 C14 C18 C22 C36 C37 C41 C44 C56 C74 = LAUNCHXL2_570LC43_RM57L:C-US: CAPACITOR, American symbol; PARTNO: CC0201KRX7R8BB102
C4 C8 C46 C50 = LAUNCHXL2_570LC43_RM57L:C-US: CAPACITOR, American symbol; PARTNO: C0805C106K8PACTU
C5 C9 C12 C15 C17 C19 C21 C29 C38 C43 C45 C47 C48 C52 C58-C61 C63 C68 C73 C75 C76 C84 = LAUNCHXL2_570LC43_RM57L:C-US: CAPACITOR, American symbol; PARTNO: CL03A104MQ3NNNC
C6 C10 C13 C16 C20 C23 C35 C40 C42 C49 C57 C62 C70 C72 = LAUNCHXL2_570LC43_RM57L:C-US: CAPACITOR, American symbol; PARTNO: CL03A103KQ3NNNC
C24 C31 C53 C54 = LAUNCHXL2_570LC43_RM57L:C-US: CAPACITOR, American symbol; PARTNO: GRM033R71A472KA01D
C25 C27 C30 C32 C33 = LAUNCHXL2_570LC43_RM57L:C-US: CAPACITOR, American symbol; PARTNO: CL21A226MQQNNNE
C28 C65 C67 C71 = LAUNCHXL2_570LC43_RM57L:C-US: CAPACITOR, American symbol; PARTNO: GRM155R60J105KE19D
C51 = LAUNCHXL2_570LC43_RM57L:C-US: CAPACITOR, American symbol; PARTNO: CC0603KRX5R5BB475
C55 = LAUNCHXL2_570LC43_RM57L:C-US: CAPACITOR, American symbol; PARTNO: GRM31CR60J107ME39L
C77-C83 = LAUNCHXL2_570LC43_RM57L:C-US: CAPACITOR, American symbol; DNP: T; PARTNO: CC0201KRX7R8BB102
FB1 FB2 = LAUNCHXL2_570LC43_RM57L:FERRITEBEAD2: A Ferrite Bead(Alternate symbol); PARTNO: CIS10P300AC
FID1-FID5 = LAUNCHXL2_570LC43_RM57L:FIDUCIAL: For use by pick and place machines to calibrate the vision/machine, 1mm By microbuilder.eu; BOM: EXCLUDE; PARTNO: BOM_EXCLUDE
J1-J4 = LAUNCHXL2_570LC43_RM57L:PINHD-1X10: PIN HEADER; PARTNO: CRD-081413-A-F
J5-J8 = LAUNCHXL2_570LC43_RM57L:PINHD-1X10: PIN HEADER; DNP: T; PARTNO: CRD-081413-A-F
J9 J10 = LAUNCHXL2_570LC43_RM57L:PINHD-1X50; DNP: T; PARTNO: TSW-150-07-T-S
J11 = LAUNCHXL2_570LC43_RM57L:MAGJACK; PARTNO: ARJC02-111006K
J12-J15 = LAUNCHXL2_570LC43_RM57L:DF40C-60DP-0.4V(51); PARTNO: DF40C-60DP-0.4V(51)
J16 = LAUNCHXL2_570LC43_RM57L:USB_MICRO_B_SMD; PARTNO: 10118192-0001LF
J17 = LAUNCHXL2_570LC43_RM57L:JACK-PLUG: DC POWER JACK Power Jack, DC, Right Angle, Through Hole, Rated 5A at 16VDC, PC Terminals Distributor: Farnell (www.Farnell.de) Drawing: 84N1161.pdf / 84N1162.pdf Manufacturer: SPC Technology (www.spctechnology.com) Type: SPC4077 / SPC 4078; DNP: T; PARTNO: FTSH-105-01-F-DV
J18 = LAUNCHXL2_570LC43_RM57L:PINHD-2X10: PIN HEADER; DNP: T; PARTNO: FTR-110-51-S-D-06
J19 = LAUNCHXL2_570LC43_RM57L:FTSH-105-01-F-DV; DNP: T; PARTNO: PJ-002BH-SMT-TR
JP2-JP6 = LAUNCHXL2_570LC43_RM57L:JP1E: JUMPER; DNP: T; PARTNO: GEC02DABN-M30
L1 L2 = LAUNCHXL2_570LC43_RM57L:L-US: INDUCTOR, American symbol; PARTNO: CIG22E1R0MNE
LED1 LED9 = LAUNCHXL2_570LC43_RM57L:LED; PARTNO: LS Q976-NR-1
LED2 LED3 LED6-LED8 = LAUNCHXL2_570LC43_RM57L:LED; PARTNO: QBLP601-AG
MH1-MH4 = LAUNCHXL2_570LC43_RM57L:MH; BOM: EXCLUDE; PARTNO: BOM_EXCLUDE
PTC1 = LAUNCHXL2_570LC43_RM57L:PTC; PARTNO: 0ZCG0300FF2B
R1-R3 R8 R9 R11 R47 = LAUNCHXL2_570LC43_RM57L:R-US_: RESISTOR, American symbol; PARTNO: RC0201JR-070RL
R4 = LAUNCHXL2_570LC43_RM57L:R-US_: RESISTOR, American symbol; DNP: T; PARTNO: RC0201JR-070RL
R5 R20 R25 = LAUNCHXL2_570LC43_RM57L:R-US_: RESISTOR, American symbol; PARTNO: CRCW02014K87FKED
R6 R19 R26 = LAUNCHXL2_570LC43_RM57L:R-US_: RESISTOR, American symbol; PARTNO: RC0603F8451CS
R7 R23 R24 R36-R38 R40 R46 = LAUNCHXL2_570LC43_RM57L:R-US_: RESISTOR, American symbol; PARTNO: CRCW020149R9FNED
R18 R28 = LAUNCHXL2_570LC43_RM57L:R-US_: RESISTOR, American symbol; PARTNO: RC0201JR-0727KL
R21 = LAUNCHXL2_570LC43_RM57L:R-US_: RESISTOR, American symbol; PARTNO: RC0603J5R1CS
R29 = LAUNCHXL2_570LC43_RM57L:R-US_: RESISTOR, American symbol; PARTNO: RL0816T-R010-F
R30 R31 = LAUNCHXL2_570LC43_RM57L:R-US_: RESISTOR, American symbol; PARTNO: RC0603F334CS
R34 R35 R43 = LAUNCHXL2_570LC43_RM57L:R-US_: RESISTOR, American symbol; PARTNO: RC0603F224CS
R44 = LAUNCHXL2_570LC43_RM57L:R-US_: RESISTOR, American symbol; PARTNO: RC0201JR-071ML
R45 = LAUNCHXL2_570LC43_RM57L:R-US_: RESISTOR, American symbol; PARTNO: CRCW020161K9FKED
RP1-RP8 = LAUNCHXL2_570LC43_RM57L:R-ARRAY-8; PARTNO: MNR18E0APJ560
RP9-RP12 = LAUNCHXL2_570LC43_RM57L:R-ARRAY-8; PARTNO: MNR18E0APJ222
S1-S5 = LAUNCHXL2_570LC43_RM57L:TACT6MM_NO_MOM; PARTNO: PTS645SM43SMTR92 LFS
U1 = LAUNCHXL2_570LC43_RM57L:RM57L843_TMS570LC4357_ZWT_337; PARTNO: TMP5704357AZWTQQ1
U2 = LAUNCHXL2_570LC43_RM57L:TPS3106K33_DBV_6; PARTNO: TPS3106K33DBVR
U3 = LAUNCHXL2_570LC43_RM57L:TPD4E004_DRY_6; PARTNO: TPD4E004DRYR
U4 = LAUNCHXL2_570LC43_RM57L:DP83630_RHS_48; PARTNO: DP83630SQE/NOPB
U5 = LAUNCHXL2_570LC43_RM57L:LM26420_PWP_20; PARTNO: LM26420XMHX/NOPB
U6 = LAUNCHXL2_570LC43_RM57L:INA210_DCK_6; PARTNO: INA210BIDCKR
U7 = LAUNCHXL2_570LC43_RM57L:TM4C129ENCPDT; PARTNO: TM4C129ENCPDTI3
U8 = LAUNCHXL2_570LC43_RM57L:LM4040D30_DBZ_3; PARTNO: LM4040D20IDBZR
U9 = LAUNCHXL2_570LC43_RM57L:TPS2553_DBV_6; PARTNO: TPS2553DBVR
U10 = LAUNCHXL2_570LC43_RM57L:TRIMPOT; PARTNO: PVZ2A102C04B00
Y1 Y2 = LAUNCHXL2_570LC43_RM57L:CRYSTAL: CRYSTAL; PARTNO: ECS-160-20-3X-TR

## Net classes
0 default: width 0.102 mm, drill 0.203 mm, clearance 0.102 mm
1 USBD: width 0.406 mm, drill 0.254 mm, clearance 0.102 mm to class 0, clearance 0.102 mm
2 ETHTD: width 0.203 mm, drill 0.203 mm, clearance 0.102 mm to class 0, clearance 0.102 mm to class 1, clearance 0.102 mm
3 ETHRD: width 0.203 mm, drill 0.203 mm, clearance 0.102 mm to class 0, clearance 0.102 mm to class 1, clearance 0.102 mm to class 2, clearance 0.102 mm
4 EMIF: width 0.102 mm, drill 0.203 mm, clearance 0.102 mm to class 0, clearance 0.102 mm to class 1, clearance 0.102 mm to class 2, clearance 0.102 mm to class 3, clearance 0.102 mm
5 ETM: width 0.102 mm, drill 0.203 mm, clearance 0.102 mm to class 0, clearance 0.102 mm to class 1, clearance 0.102 mm to class 2, clearance 0.102 mm to class 3, clearance 0.102 mm to class 4, clearance 0.102 mm
6 ETHER: width 0.102 mm, drill 0.203 mm, clearance 0.102 mm to class 0, clearance 0.102 mm to class 1, clearance 0.102 mm to class 2, clearance 0.102 mm to class 3, clearance 0.102 mm to class 4, clearance 0.102 mm to class 5, clearance 0.102 mm
7 pwr: width 0.102 mm, drill 0.203 mm, clearance 0.102 mm to class 0, clearance 0.102 mm to class 1, clearance 0.102 mm to class 2, clearance 0.102 mm to class 3, clearance 0.102 mm to class 4, clearance 0.102 mm to class 5, clearance 0.102 mm to class 6, clearance 0.102 mm